# Altium schematic sheet Serial.SchDoc
size A3; PageSetup: Record=PageOptions|CenterHorizontal=True|CenterVertical=True|PrintScale=0.73|XCorrection=1.00|YCorrection=1.00|PrintKind=0|BorderSize=5000000|LeftOffset=0|BottomOffset=0|Orientation=2|PaperLength=1000|PaperWidth=1000|Scale=100|PaperSource=7|PrintQuality=-4|MediaType=1|DitherType=10|PaperKind=A4|PrintScaleMode=1; Date: 27.05.2014; DrawnBy: luths8; Organization: BFH; Address1: Bern University of Applied Sciences; Address2: Engineering and Information Technology; Address3: Jlcoweg 1; Address4: CH-3400 Burgdorf; DocumentNumber: 12; Revision: 1.0; SheetNumber: 15; SheetTotal: 19; CurrentDate: 27.05.2014
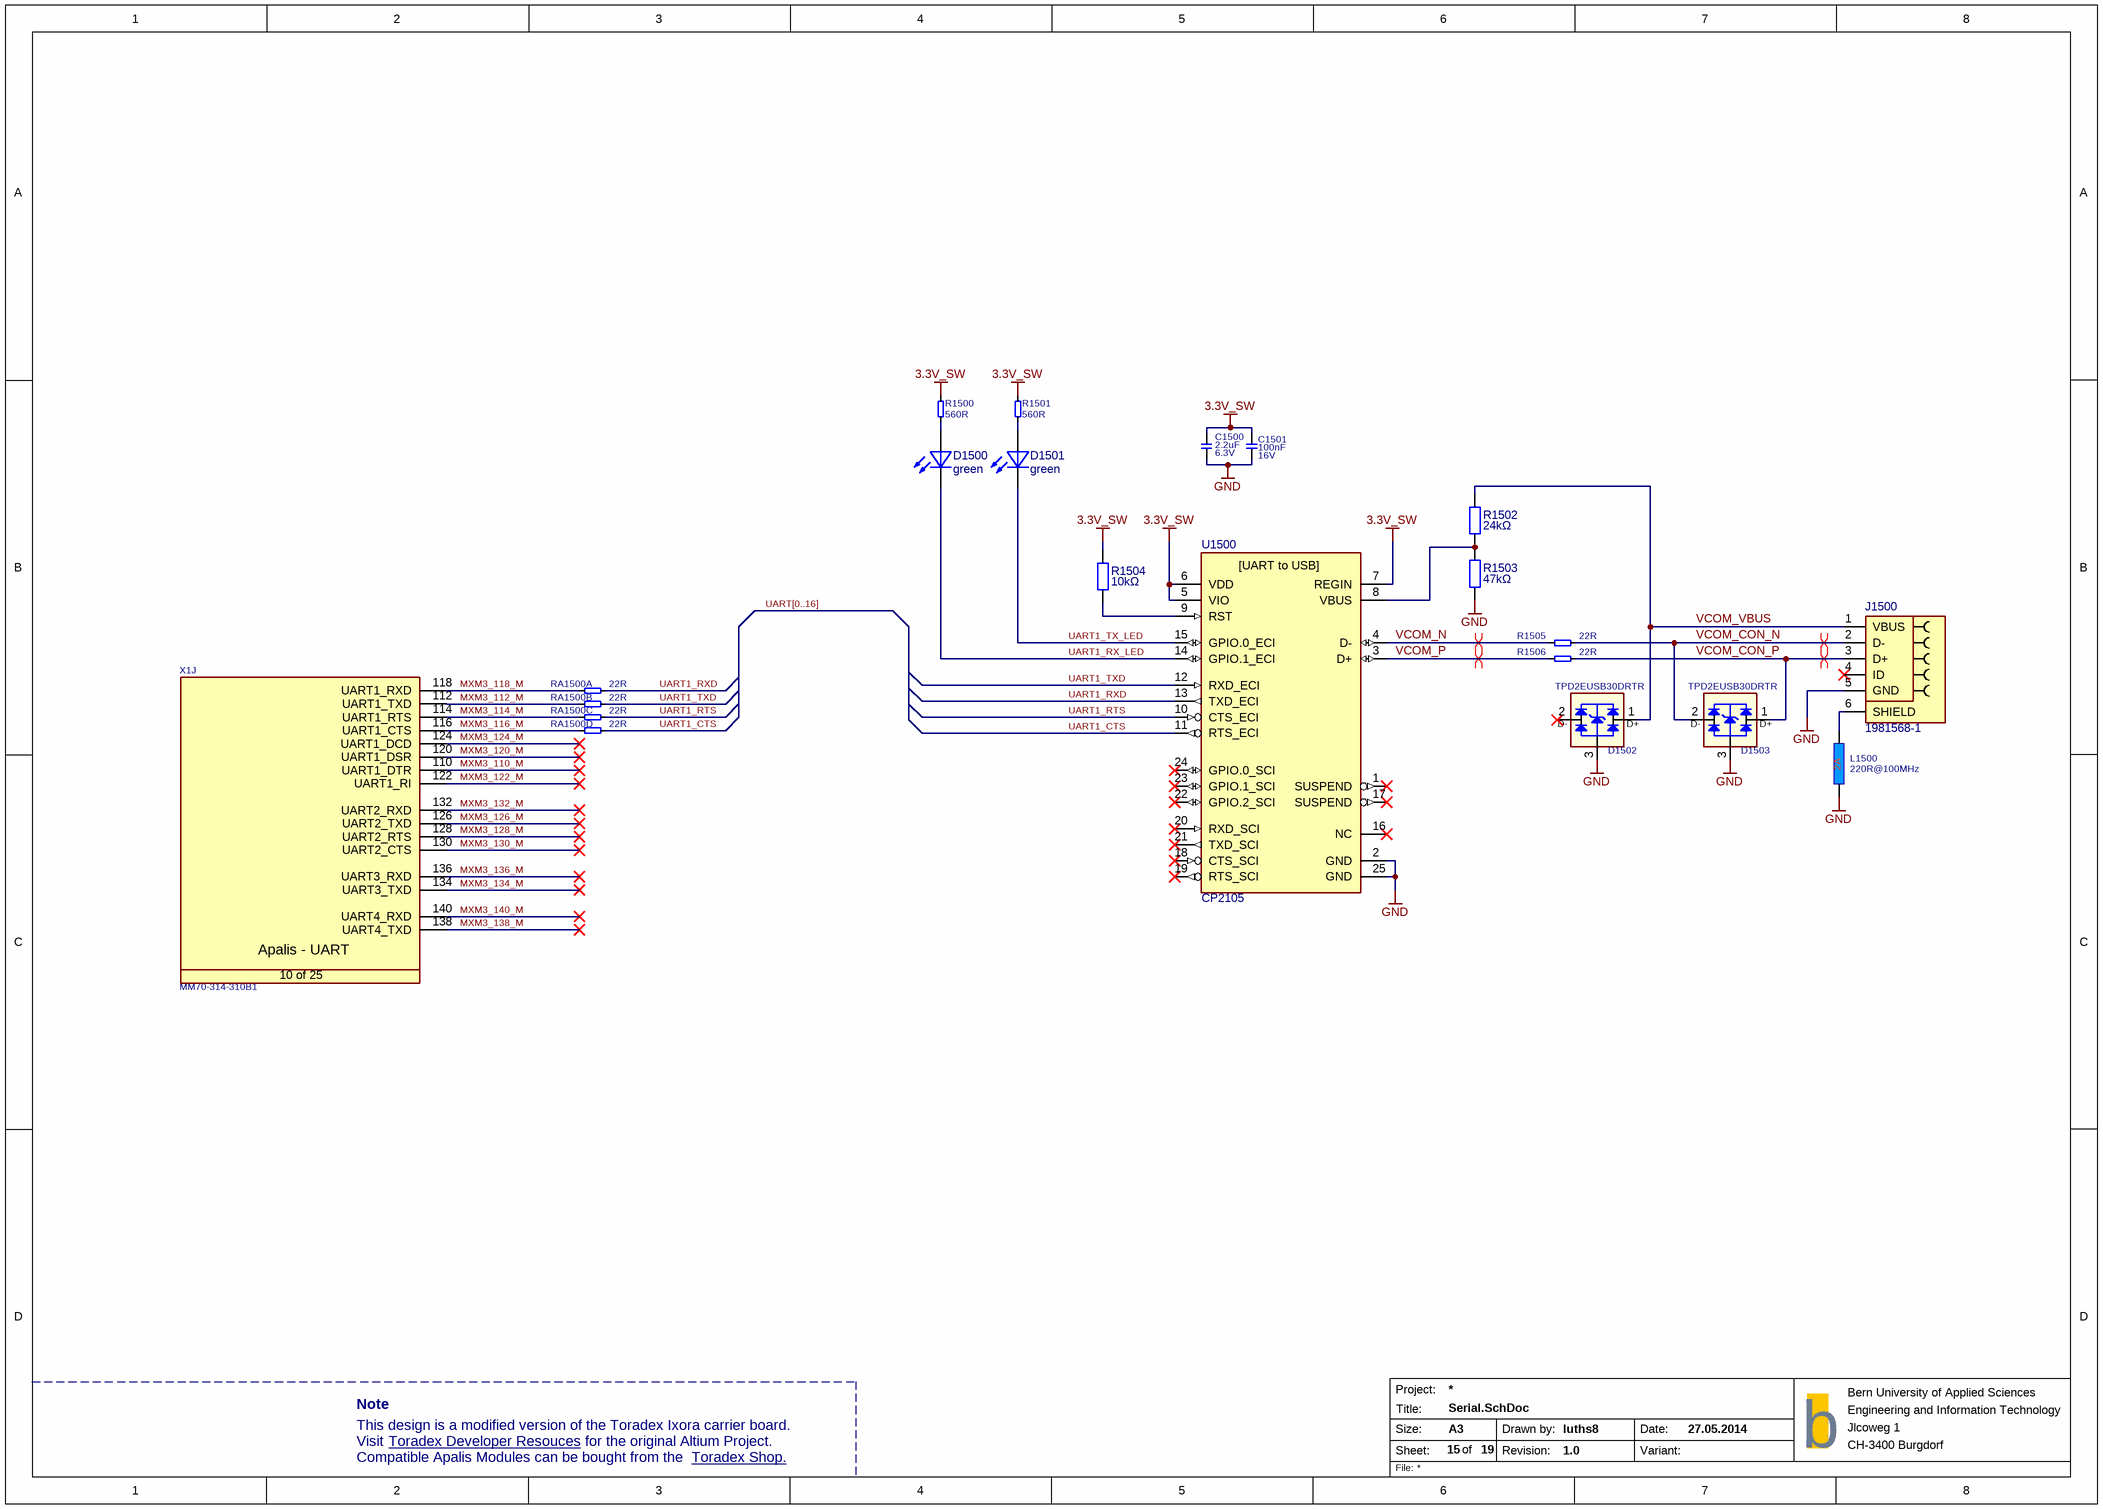
[diagram p0: Serial.SchDoc]

## Parts
C1500  Rating: 6.3V  [SMD0603CAP]  (hidden comment: 2.2uF)
C1501  Rating: 16V  [SMD0603CAP]  (hidden comment: 100nF)
D1500  green  [LED]
D1501  green  [LED]
D1502  TPD2EUSB30DRTR  [T_TI_TPD2EUSB30DRTR]
D1503  TPD2EUSB30DRTR  [T_TI_TPD2EUSB30DRTR]
J1500  1981568-1  [HEADER_USB]
L1500  220R@100MHz  [INDC1608X95N]
R1500  560R  [SMD0603RES]
R1501  560R  [SMD0603RES]
R1502  24kΩ  [SMD0603RES]
R1503  47kΩ  [SMD0603RES]
R1504  10kΩ  [SMD0603RES]
R1505  22R  [SMD0603RES]
R1506  22R  [SMD0603RES]
RA1500  22R  [T_Resistor_Array_X4]  (parts A,B,C,D of 4)
U1500  CP2105  [QFN24]
X1  Manufacturer Part No.: MM70-314-310B1  [T_JAE_MM70-314-310B1]  (hidden comment: CON-JAE-MM70-314-310B1-314-0.5mm)  (part J of 25)

## Nets
3.3V_SW: C1500.2 C1501.2 R1500.1 R1501.1 R1504.2 U1500.5(VIO) U1500.6(VDD) U1500.7(REGIN)
GND: C1500.1 C1501.1 D1502.3 D1503.3 J1500.5(GND) L1500.1 R1503.1 U1500.2(GND) U1500.25(GND)
MXM3_110_M: X1.110(UART1_DTR)
MXM3_112_M: RA1500.1 X1.112(UART1_TXD)
MXM3_114_M: RA1500.2 X1.114(UART1_RTS)
MXM3_116_M: RA1500.3 X1.116(UART1_CTS)
MXM3_118_M: RA1500.4 X1.118(UART1_RXD)
MXM3_120_M: X1.120(UART1_DSR)
MXM3_122_M: X1.122(UART1_RI)
MXM3_124_M: X1.124(UART1_DCD)
MXM3_126_M: X1.126(UART2_TXD)
MXM3_128_M: X1.128(UART2_RTS)
MXM3_130_M: X1.130(UART2_CTS)
MXM3_132_M: X1.132(UART2_RXD)
MXM3_134_M: X1.134(UART3_TXD)
MXM3_136_M: X1.136(UART3_RXD)
MXM3_138_M: X1.138(UART4_TXD)
MXM3_140_M: X1.140(UART4_RXD)
UART1_CTS: RA1500.7 U1500.11(RTS_ECI)
UART1_RTS: RA1500.6 U1500.10(CTS_ECI)
UART1_RX_LED: D1500.C U1500.14(GPIO.1_ECI)
UART1_RXD: RA1500.8 U1500.13(TXD_ECI)
UART1_TX_LED: D1501.C U1500.15(GPIO.0_ECI)
UART1_TXD: RA1500.5 U1500.12(RXD_ECI)
VCOM_CON_N: D1503.2(D-) J1500.2(D-) R1505.2
VCOM_CON_P: D1503.1(D+) J1500.3(D+) R1506.2
VCOM_N: R1505.1 U1500.4(D-)
VCOM_P: R1506.1 U1500.3(D+)
VCOM_VBUS: D1502.1(D+) J1500.1(VBUS) R1502.2
NetD1500_A: D1500.A R1500.2
NetD1501_A: D1501.A R1501.2
NetJ1500_6: J1500.6(SHIELD) L1500.2
NetR1502_1: R1502.1 R1503.2 U1500.8(VBUS)
NetR1504_1: R1504.1 U1500.9(RST)

Not connected (* = marked no-connect by the designer): D1502 2(D-)*; J1500 4(ID)*; U1500 1(SUSPEND)* 16(NC)* 17(SUSPEND)* 18(CTS_SCI)* 19(RTS_SCI)* 20(RXD_SCI)* 21(TXD_SCI)* 22(GPIO.2_SCI)* 23(GPIO.1_SCI)* 24(GPIO.0_SCI)*

## Buses and harness runs
bus UART[0..16]

## Layout directives
differential pair: VCOM_CON_N, VCOM_CON_P, VCOM_N, VCOM_P

## Notes on the sheet
- Note
- This design is a modified version of the Toradex Ixora carrier board.
- Visit
- Compatible Apalis Modules can be bought from the
- Toradex Developer Resouces <https://developer.toradex.com/products/ixora-carrier-board>
- for the original Altium Project.
- Toradex Shop. <https://www.toradex.com/order-now/apalis-arm-family>
- Project:
- Size:
- Sheet:
- Title:
- A3
- of
- Drawn by:
- Revision:
- Date:
- Variant:
- b
- File:
- (in symbol CON-JAE-MM70-314-310B1-314-0.5mm, part J) Apalis - UART; 10 of 25
- (in symbol CP2105) [UART to USB]

## Library data of the parts
C1500 = C-X5R-2.2uF-6.3V-20%-0603: Capacitor Ceramic X5R 2.2uF 6.3V 20% 0603; Tolerance: 20%; Type: X5R; Value: 2.2uF
C1501 = C-X7R-100nF-16V-10%-0402: Capacitor Ceramic X7R 100nF 16V 10% 0603; Tolerance: 10%; Type: X7R; Value: 100nF
D1500 D1501 = LED green: Manufacturer Part No.: LGM67KG1J224Z
D1502 D1503 = D-TI-TPD2EUSB30DRTR: 2 Channel Protection for Super Speed USB3.0; Manufacturer Name: TI; Manufacturer Part No.: TPD2EUSB30DRTR
J1500 = Connector USB: USB Micro Connector; Manufacturer Part No.: 1981568-1
L1500 = L-220R@100MHz-2A-25%-0603: 220R@100MHz 2A EMI FILTER; Tolerance: 25%; Rating: 2A; Value: 220R@100MHz
R1500 R1501 = R-560R-63mW-5%-0402: Resistor 560 ohm 63mW 5% 0603; Rating: 63mW; Tolerance: 5%; Value: 560R
R1502-R1504 = Resistor
R1505 R1506 = R-22R-63mW-5%-0402: Resistor 22 ohm 63mW 5% 0603; Rating: 63mW; Tolerance: 5%; Value: 22R
RA1500 = RA-22R-63mW-5%-1206-div: Resistor Array 22 R 63mW 5% 1206; Tolerance: 5%; Power Dissipation: 63mW; Value: 22R
U1500 = CP2105: USB to UART Bridge; Manufacturer Part No.: CP2105-F01-GMR
X1 = CON-JAE-MM70-314-310B1-314-0.5mm: MXM3 Connector; Manufacturer Name: JAE; No. of ways: 314